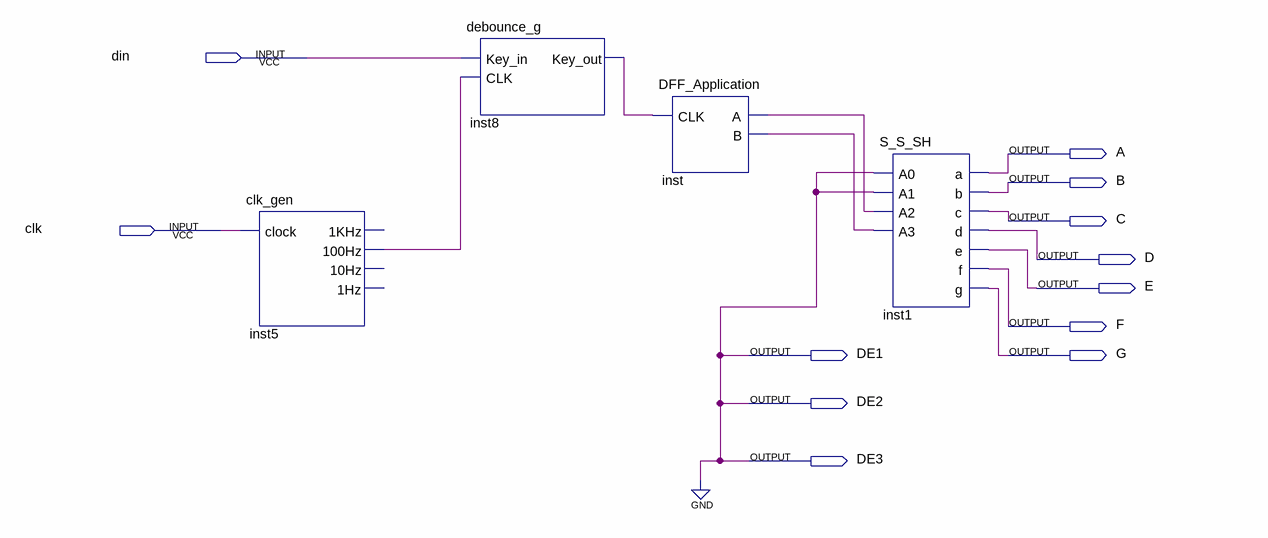
[diagram p0: schematic sheet]
// Quartus schematic debounce_test.bdf as structural Verilog: 4 symbols, 12 pins
module debounce_test (
  input  din,
  input  clk,
  output A,
  output B,
  output C,
  output D,
  output E,
  output F,
  output DE1,
  output G,
  output DE2,
  output DE3
);

  wire inst5_100hz, inst8_key_out, inst_a, inst_b;

  clk_gen inst5 (.clock(clk), .\100Hz (inst5_100hz));  // open: 1KHz, 10Hz, 1Hz
  debounce_g inst8 (.Key_in(din), .CLK(inst5_100hz), .Key_out(inst8_key_out));
  DFF_Application inst (.CLK(inst8_key_out), .A(inst_a), .B(inst_b));
  S_S_SH inst1 (.A0(1'b0), .A1(1'b0), .A2(inst_a), .A3(inst_b), .a(A), .b(B), .c(C), .d(D), .e(E), .f(F), .g(G));

  assign DE1 = 1'b0;
  assign DE2 = 1'b0;
  assign DE3 = 1'b0;
endmodule
